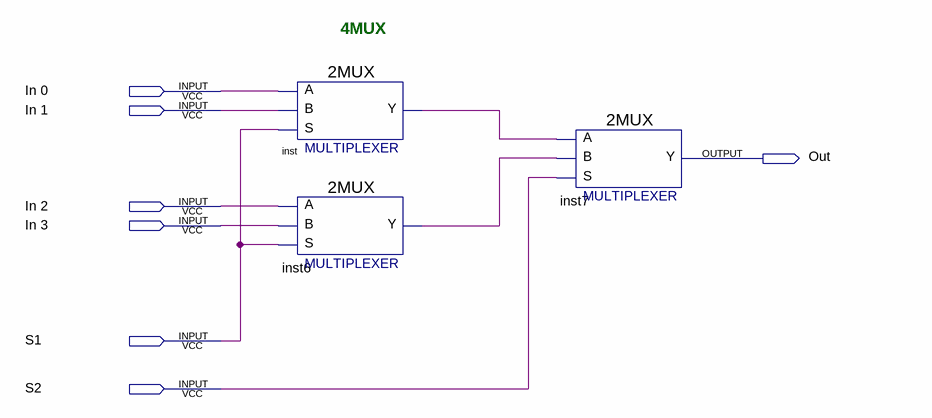
[diagram p0: schematic sheet]
// Quartus schematic 4MUX.bdf as structural Verilog: 3 symbols, 7 pins
module \4MUX  (
  input  \In_0 ,
  input  \In_1 ,
  input  \In_2 ,
  input  \In_3 ,
  input  S1,
  input  S2,
  output Out
);

  wire inst6_y, inst_y;

  \2MUX  inst (.S(S1), .B(\In_1 ), .A(\In_0 ), .Y(inst_y));
  \2MUX  inst6 (.S(S1), .B(\In_3 ), .A(\In_2 ), .Y(inst6_y));
  \2MUX  inst7 (.S(S2), .B(inst6_y), .A(inst_y), .Y(Out));

  // Notes on the sheet:
  //   4MUX
endmodule
